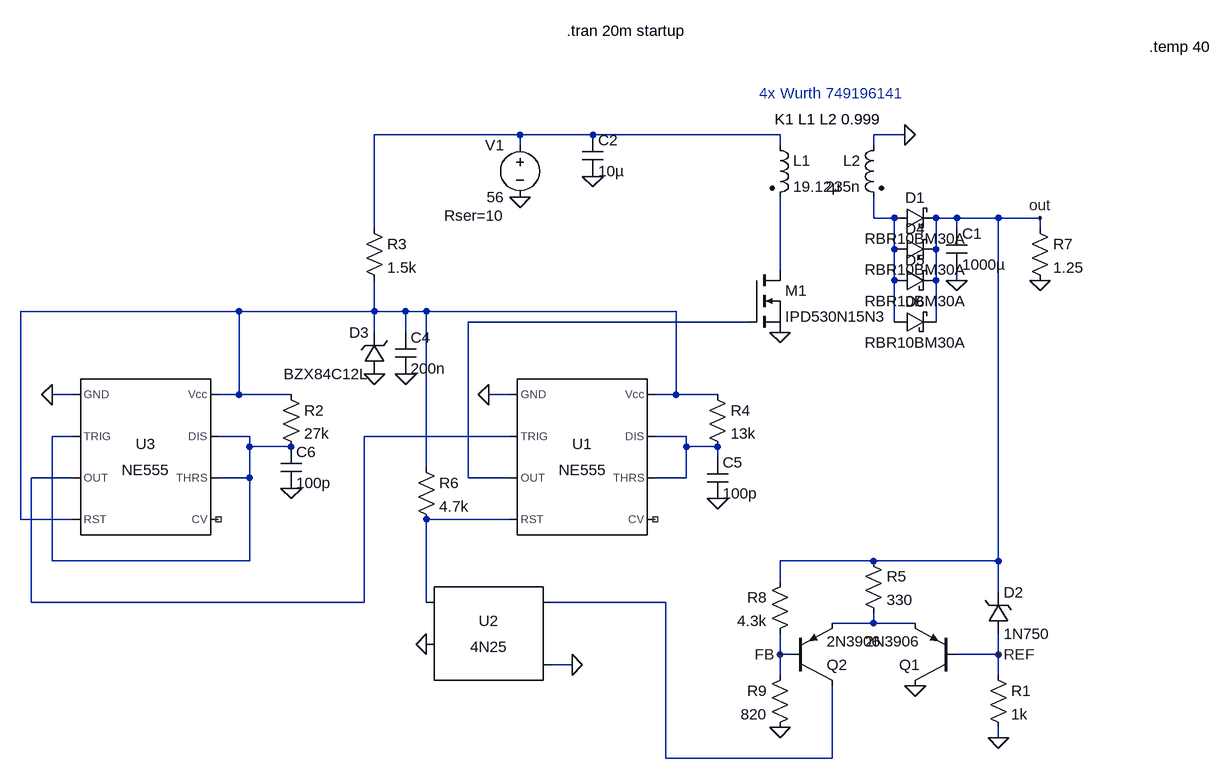
[diagram p0: schematic poe.asc]
poe.asc, the LTspice schematic file:
Version 4
SHEET 1 880 1044
WIRE -240 32 -464 32
WIRE -128 32 -240 32
WIRE 160 32 -128 32
WIRE 352 32 304 32
WIRE -240 48 -240 32
WIRE 160 48 160 32
WIRE 304 48 304 32
WIRE 304 160 304 128
WIRE 336 160 304 160
WIRE 432 160 400 160
WIRE 496 160 432 160
WIRE 560 160 496 160
WIRE -464 176 -464 32
WIRE 432 176 432 160
WIRE 560 176 560 160
WIRE 336 208 336 160
WIRE 400 208 400 160
WIRE 160 240 160 128
WIRE 336 256 336 208
WIRE 400 256 400 208
WIRE 432 256 432 240
WIRE -672 304 -1008 304
WIRE -464 304 -464 256
WIRE -464 304 -672 304
WIRE -416 304 -464 304
WIRE -384 304 -416 304
WIRE 0 304 -384 304
WIRE 112 320 -320 320
WIRE 336 320 336 256
WIRE 400 320 400 256
WIRE -464 336 -464 304
WIRE -416 336 -416 304
WIRE -928 432 -960 432
WIRE -672 432 -672 304
WIRE -672 432 -704 432
WIRE -592 432 -672 432
WIRE -256 432 -288 432
WIRE 0 432 0 304
WIRE 0 432 -32 432
WIRE 64 432 0 432
WIRE -928 496 -960 496
WIRE -656 496 -704 496
WIRE -256 496 -480 496
WIRE 16 496 -32 496
WIRE -656 512 -656 496
WIRE -592 512 -656 512
WIRE 16 512 16 496
WIRE 64 512 16 512
WIRE 64 528 64 512
WIRE -384 544 -384 304
WIRE -928 560 -992 560
WIRE -656 560 -656 512
WIRE -656 560 -704 560
WIRE -320 560 -320 320
WIRE -256 560 -320 560
WIRE 16 560 16 512
WIRE 16 560 -32 560
WIRE -1008 624 -1008 304
WIRE -928 624 -1008 624
WIRE -256 624 -384 624
WIRE -960 688 -960 496
WIRE -656 688 -656 560
WIRE -656 688 -960 688
WIRE 304 688 160 688
WIRE 496 688 496 160
WIRE 496 688 304 688
WIRE 160 720 160 688
WIRE 496 736 496 688
WIRE -992 752 -992 560
WIRE -480 752 -480 496
WIRE -480 752 -992 752
WIRE -384 752 -384 624
WIRE -16 752 -192 752
WIRE 304 784 304 768
WIRE 304 784 240 784
WIRE 368 784 304 784
WIRE 160 832 160 800
WIRE 176 832 160 832
WIRE 496 832 496 800
WIRE 496 832 432 832
WIRE -160 848 -192 848
WIRE 160 864 160 832
WIRE 496 864 496 832
WIRE 496 960 496 944
WIRE -16 992 -16 752
WIRE 240 992 240 880
WIRE 240 992 -16 992
FLAG 432 256 0
FLAG -240 128 0
FLAG -464 400 0
FLAG -416 400 0
FLAG -288 432 0
FLAG 560 256 0
FLAG 352 32 0
FLAG -384 816 0
FLAG -128 96 0
FLAG 560 160 out
FLAG 160 336 0
FLAG -960 432 0
FLAG 64 592 0
FLAG -592 576 0
FLAG 496 960 0
FLAG 160 944 0
FLAG 496 832 REF
FLAG 160 832 FB
FLAG 368 880 0
FLAG -160 848 0
SYMBOL ind2 144 32 R0
SYMATTR InstName L1
SYMATTR Value 19.12µ
SYMATTR Type ind
SYMATTR SpiceLine Rser=1.03
SYMBOL ind2 320 32 M0
SYMATTR InstName L2
SYMATTR Value 235n
SYMATTR Type ind
SYMATTR SpiceLine Rser=115m
SYMBOL schottky 336 176 R270
WINDOW 0 32 32 VTop 2
WINDOW 3 0 32 VBottom 2
SYMATTR InstName D1
SYMATTR Value RBR10BM30A
SYMATTR Description Diode
SYMATTR Type diode
SYMBOL cap 416 176 R0
SYMATTR InstName C1
SYMATTR Value 1000µ
SYMBOL voltage -240 32 M0
WINDOW 123 0 0 Left 0
WINDOW 39 24 124 Left 2
SYMATTR InstName V1
SYMATTR Value 56
SYMATTR SpiceLine Rser=10
SYMBOL nmos 112 240 R0
SYMATTR InstName M1
SYMATTR Value IPD530N15N3
SYMBOL Misc\\NE555 -144 528 R0
SYMATTR InstName U1
SYMBOL zener -448 400 R180
WINDOW 0 24 64 Left 2
WINDOW 3 24 0 Left 2
SYMATTR InstName D3
SYMATTR Value BZX84C12L
SYMATTR Description Diode
SYMATTR Type diode
SYMBOL res -480 160 R0
SYMATTR InstName R3
SYMATTR Value 1.5k
SYMBOL cap -432 336 R0
SYMATTR InstName C4
SYMATTR Value 200n
SYMBOL res -400 528 R0
SYMATTR InstName R6
SYMATTR Value 4.7k
SYMBOL res 544 160 R0
SYMATTR InstName R7
SYMATTR Value 1.25
SYMBOL Optos\\4N25 -288 816 M0
SYMATTR InstName U2
SYMBOL res 48 416 R0
SYMATTR InstName R4
SYMATTR Value 13k
SYMBOL cap -144 32 R0
SYMATTR InstName C2
SYMATTR Value 10µ
SYMBOL Misc\\NE555 -816 528 R0
SYMATTR InstName U3
SYMBOL cap 48 528 R0
SYMATTR InstName C5
SYMATTR Value 100p
SYMBOL res -608 416 R0
SYMATTR InstName R2
SYMATTR Value 27k
SYMBOL cap -608 512 R0
SYMATTR InstName C6
SYMATTR Value 100p
SYMBOL zener 480 800 M180
WINDOW 0 24 64 Left 2
WINDOW 3 24 0 Left 2
SYMATTR InstName D2
SYMATTR Value 1N750
SYMATTR Description Diode
SYMATTR Type diode
SYMBOL res 480 848 R0
SYMATTR InstName R1
SYMATTR Value 1k
SYMBOL pnp 432 880 R180
SYMATTR InstName Q1
SYMATTR Value 2N3906
SYMBOL pnp 176 880 M180
SYMATTR InstName Q2
SYMATTR Value 2N3906
SYMBOL res 288 672 R0
SYMATTR InstName R5
SYMATTR Value 330
SYMBOL res 176 704 M0
SYMATTR InstName R8
SYMATTR Value 4.3k
SYMBOL res 176 848 M0
SYMATTR InstName R9
SYMATTR Value 820
SYMBOL schottky 336 224 R270
WINDOW 0 32 32 VTop 2
WINDOW 3 0 32 VBottom 2
SYMATTR InstName D4
SYMATTR Value RBR10BM30A
SYMATTR Description Diode
SYMATTR Type diode
SYMBOL schottky 336 272 R270
WINDOW 0 32 32 VTop 2
WINDOW 3 0 32 VBottom 2
SYMATTR InstName D5
SYMATTR Value RBR10BM30A
SYMATTR Description Diode
SYMATTR Type diode
SYMBOL schottky 336 336 R270
WINDOW 0 32 32 VTop 2
WINDOW 3 0 32 VBottom 2
SYMATTR InstName D6
SYMATTR Value RBR10BM30A
SYMATTR Description Diode
SYMATTR Type diode
TEXT 152 8 Left 2 !K1 L1 L2 0.999
TEXT -168 -128 Left 2 !.tran 20m startup
TEXT 728 -104 Left 2 !.temp 40
TEXT 128 -32 Left 2 ;4x Wurth 749196141

The netlist it stands for:
* poe.asc
L1 N001 N003 19.12µ Rser=1.03
L2 0 N002 235n Rser=115m
D1 N002 out RBR10BM30A
C1 out 0 1000µ
V1 N001 0 56 Rser=10
M1 N003 N005 0 0 IPD530N15N3
XU1 0 N007 N005 N009 NC_01 N008 N008 N004 NE555  ; pins GND TRIG OUT RST CV THRS DIS Vcc
D3 0 N004 BZX84C12L
R3 N001 N004 1.5k
C4 N004 0 200n
R6 N004 N009 4.7k
R7 out 0 1.25
XU2 N010 0 N009 0 NC_02 4N25
R4 N004 N008 13k
C2 N001 0 10µ
XU3 0 N006 N007 N004 NC_03 N006 N006 N004 NE555  ; pins GND TRIG OUT RST CV THRS DIS Vcc
C5 N008 0 100p
R2 N004 N006 27k
C6 N006 0 100p
D2 REF out 1N750
R1 REF 0 1k
Q1 0 REF N011 0 2N3906
Q2 N010 FB N011 0 2N3906
R5 out N011 330
R8 out FB 4.3k
R9 FB 0 820
D4 N002 out RBR10BM30A
D5 N002 out RBR10BM30A
D6 N002 out RBR10BM30A
.model D D
.lib standard.dio
.model NPN NPN
.model PNP PNP
.lib standard.bjt
.model NMOS NMOS
.model PMOS PMOS
.lib standard.mos
K1 L1 L2 0.999
.tran 20m startup
.temp 40
* 4x Wurth 749196141
.lib NE555.sub
.lib 4N25.sub
.backanno
.end